# Altium project ESP32 Breakout Board V0.PrjPcb
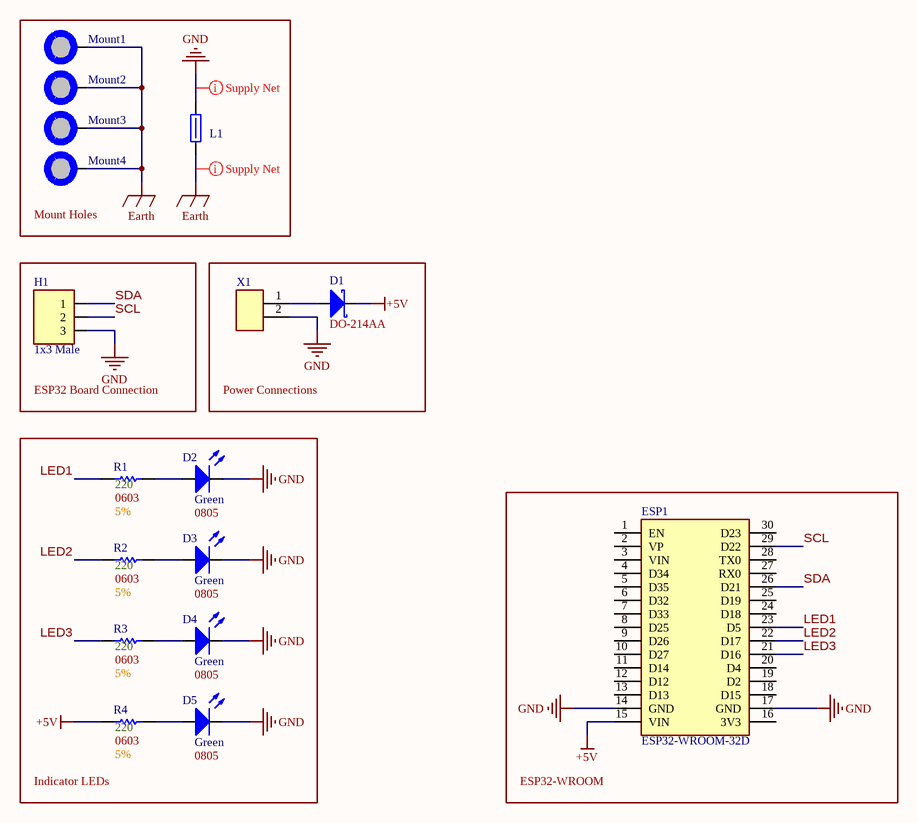
[diagram p0: ESP32 Connection.SchDoc]
1 sheet, 17 parts. Net scope: global (net labels, ports and power ports of the same name join across sheets).
Board file: Main.PcbDoc

## Sheet ESP32 Connection.SchDoc
size A; SheetNumber: 1; SheetTotal: 1

### Parts
D1  Size Package: DO-214AA  [[Diode] SMD DO-214AA]  (hidden comment: Schottky)
D2  Color: Green  Size Package: 0805  [[LED] SMD 0805]  (hidden comment: SMD LED)
D3  Color: Green  Size Package: 0805  [[LED] SMD 0805]  (hidden comment: SMD LED)
D4  Color: Green  Size Package: 0805  [[LED] SMD 0805]  (hidden comment: SMD LED)
D5  Color: Green  Size Package: 0805  [[LED] SMD 0805]  (hidden comment: SMD LED)
ESP1  ESP32-WROOM-32D  [[Device] ESP32-WROOM-32D]
H1  1x3 Male  [[Header] Shrouded 1x3 Male]
L1  652-MH2029-300Y  [[Ferrite] SMD Bead 0805 (1)]  (value not drawn)
Mount1  M3 Mount Hole  [[Mount] M3 Mount Hole]  (value not drawn)  (no BOM)
Mount2  M3 Mount Hole  [[Mount] M3 Mount Hole]  (value not drawn)  (no BOM)
Mount3  M3 Mount Hole  [[Mount] M3 Mount Hole]  (value not drawn)  (no BOM)
Mount4  M3 Mount Hole  [[Mount] M3 Mount Hole]  (value not drawn)  (no BOM)
R1  Resistance: 220  Size Package: 0603  Tolerance: 5%  [[Res] SMD 0603]  (hidden comment: [Res] SMD Resistor)
R2  Resistance: 220  Size Package: 0603  Tolerance: 5%  [[Res] SMD 0603]  (hidden comment: [Res] SMD Resistor)
R3  Resistance: 220  Size Package: 0603  Tolerance: 5%  [[Res] SMD 0603]  (hidden comment: [Res] SMD Resistor)
R4  Resistance: 220  Size Package: 0603  Tolerance: 5%  [[Res] SMD 0603]  (hidden comment: [Res] SMD Resistor)
X1  2pin Screw Terminal  [[Screw Terminal] 2pin 5mm]  (value not drawn)

### Blocks framed on the sheet
Mount Holes: L1 Mount1-Mount4
ESP32 Board Connection: H1
Power Connections: D1 X1
Indicator LEDs: D2-D5 R1-R4
ESP32-WROOM: ESP1

### Nets
+5V: D1.1(K) ESP1.15(VIN) R4.2
Earth: L1.1 Mount1.1 Mount2.1 Mount3.1 Mount4.1
GND: D2.2(Cathode) D3.2(Cathode) D4.2(Cathode) D5.2(Cathode) ESP1.14(GND) ESP1.17(GND) H1.3 L1.2 X1.2
LED1: ESP1.23(D5) R1.2
LED2: ESP1.22(D17) R2.2
LED3: ESP1.21(D16) R3.2
SCL: ESP1.29(D22) H1.2
SDA: ESP1.26(D21) H1.1
NetD1_2: D1.2(A) X1.1
NetD2_1: D2.1(Anode) R1.1
NetD3_1: D3.1(Anode) R2.1
NetD4_1: D4.1(Anode) R3.1
NetD5_1: D5.1(Anode) R4.1

Not connected (* = marked no-connect by the designer): ESP1 1(EN) 2(VP) 3(VIN) 4(D34) 5(D35) 6(D32) 7(D33) 8(D25) 9(D26) 10(D27) 11(D14) 12(D12) 13(D13) 16(3V3) 18(D15) 19(D2) 20(D4) 24(D18) 25(D19) 27(RX0) 28(TX0) 30(D23)

### Layout directives
net class Supply_Nets: Earth, GND

### Library data of the parts
D1 = [Diode] SMD Schottky: Generic; Supplier 1: DigiKey; Supplier Part Number 1: S1MB-FDICT-ND
D2-D5 = [LED] SMD: Generic; Part #: *; Supplier 1: DigiKey; Supplier Part Number 1: 475-LGR971-KN-1DKR-ND
ESP1 = [Device] ESP32-WROOM-32D: ESP32 DEVKIT V1 - DOIT; ComponentLink1Description: Pinout; ComponentLink1URL: https://esp32.com/viewtopic.php?t=9875
H1 = [Header] Shrouded 1x3 Male: 070543-0037 / Mates with 005057-9403; Supplier 1: DigiKey; Supplier 2: DigiKey; Supplier Part Number 1: WM4825-ND; Supplier Part Number 2: WM2901-ND
L1 = [Ferrite] SMD Ferrite Bead (1): Res @ Freq: 30 @ 100MHz; Size Package: 0805; Supplier 1: DigiKey; Supplier Part Number 1: MH2029-300YCT-ND
Mount1-Mount4 = [Mount] M3 Mount Hole: Place at least 4.5mm from board edge. Plated.
R1-R4 = [Res] SMD Resistor: Generic; Supplier 1: DigiKey; Supplier Part Number 1: A129741CT-ND
X1 = [Screw Terminal] 2pin: Supplier 1: DigiKey; Supplier Part Number 1: 102-6145-ND